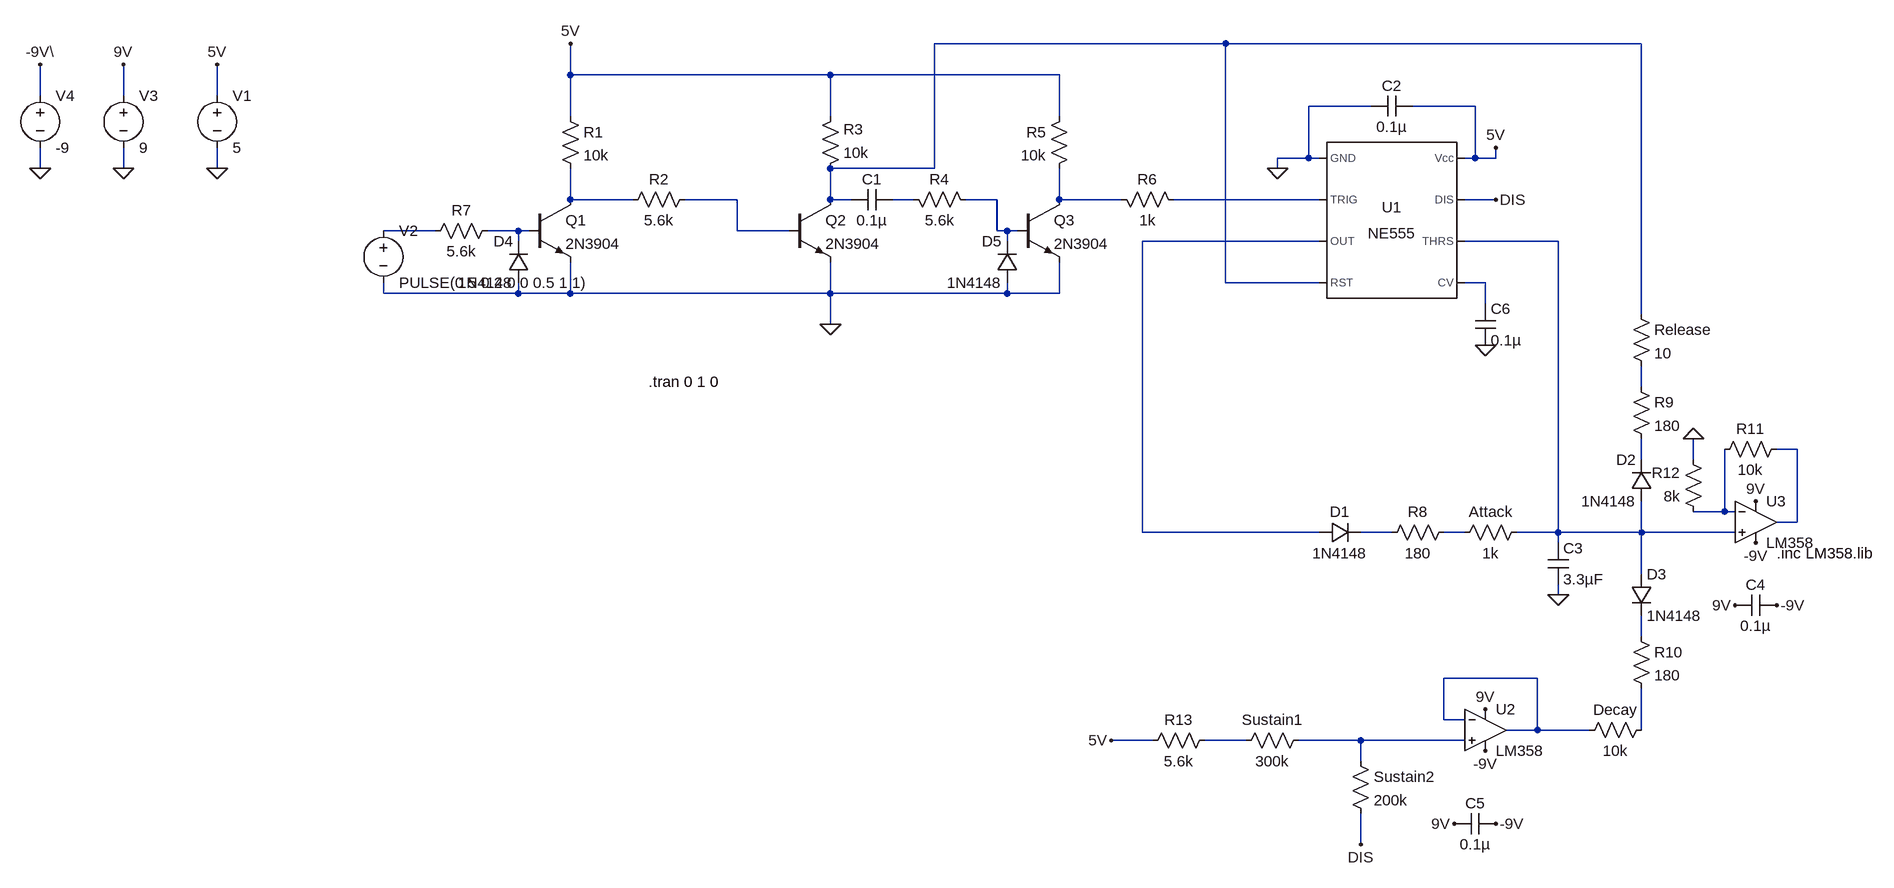
[diagram p0: schematic EnvelopeGenerator.asc]
EnvelopeGenerator.asc, the LTspice schematic file:
Version 4
SHEET 1 2560 1192
WIRE 1088 -128 640 -128
WIRE 1728 -128 1088 -128
WIRE 80 -80 80 -128
WIRE 480 -80 80 -80
WIRE 832 -80 480 -80
WIRE -736 -48 -736 -96
WIRE -608 -48 -608 -96
WIRE -464 -48 -464 -96
WIRE 1312 -32 1216 -32
WIRE 1472 -32 1376 -32
WIRE 80 -16 80 -80
WIRE 480 -16 480 -80
WIRE 832 -16 832 -80
WIRE 1216 48 1216 -32
WIRE 1216 48 1168 48
WIRE 1232 48 1216 48
WIRE 1472 48 1472 -32
WIRE 1472 48 1456 48
WIRE 1504 48 1504 32
WIRE 1504 48 1472 48
WIRE -736 64 -736 32
WIRE -608 64 -608 32
WIRE -464 64 -464 32
WIRE 640 64 640 -128
WIRE 640 64 480 64
WIRE 1168 64 1168 48
WIRE 80 112 80 64
WIRE 176 112 80 112
WIRE 336 112 256 112
WIRE 480 112 480 64
WIRE 512 112 480 112
WIRE 608 112 576 112
WIRE 736 112 688 112
WIRE 832 112 832 64
WIRE 928 112 832 112
WIRE 1232 112 1008 112
WIRE 1504 112 1456 112
WIRE -128 160 -208 160
WIRE 0 160 -48 160
WIRE 16 160 0 160
WIRE 336 160 336 112
WIRE 416 160 336 160
WIRE 736 160 736 112
WIRE 752 160 736 160
WIRE 768 160 752 160
WIRE 0 176 0 160
WIRE 752 176 752 160
WIRE 1232 176 960 176
WIRE 1600 176 1456 176
WIRE 1088 240 1088 -128
WIRE 1232 240 1088 240
WIRE 1488 240 1456 240
WIRE -208 256 -208 240
WIRE 0 256 0 240
WIRE 0 256 -208 256
WIRE 80 256 80 208
WIRE 80 256 0 256
WIRE 480 256 480 208
WIRE 480 256 80 256
WIRE 752 256 752 240
WIRE 752 256 480 256
WIRE 832 256 832 208
WIRE 832 256 752 256
WIRE 1488 272 1488 240
WIRE 1728 288 1728 -128
WIRE 480 304 480 256
WIRE 1728 400 1728 368
WIRE 1968 496 1936 496
WIRE 1728 512 1728 480
WIRE 1808 512 1808 480
WIRE 1856 592 1856 496
WIRE 1856 592 1808 592
WIRE 1872 592 1856 592
WIRE 1968 608 1968 496
WIRE 1968 608 1936 608
WIRE 960 624 960 176
WIRE 1232 624 960 624
WIRE 1344 624 1296 624
WIRE 1456 624 1424 624
WIRE 1600 624 1600 176
WIRE 1600 624 1536 624
WIRE 1728 624 1728 576
WIRE 1728 624 1600 624
WIRE 1872 624 1728 624
WIRE 1600 640 1600 624
WIRE 1728 688 1728 624
WIRE 1600 720 1600 704
WIRE 1728 784 1728 752
WIRE 1568 848 1424 848
WIRE 1424 912 1424 848
WIRE 1456 912 1424 912
WIRE 1568 928 1568 848
WIRE 1568 928 1520 928
WIRE 1648 928 1568 928
WIRE 1728 928 1728 864
WIRE 976 944 912 944
WIRE 1120 944 1056 944
WIRE 1296 944 1200 944
WIRE 1456 944 1296 944
WIRE 1296 976 1296 944
WIRE 1296 1104 1296 1056
FLAG 480 304 0
FLAG 80 -128 5V
FLAG -464 64 0
FLAG -464 -96 5V
FLAG 1168 64 0
FLAG 1504 32 5V
FLAG -608 64 0
FLAG -608 -96 9V
FLAG -736 64 0
FLAG -736 -96 -9V\
FLAG 1904 576 9V
FLAG 1904 640 -9V
FLAG 1600 720 0
FLAG 1872 736 9V
FLAG 1936 736 -9V
FLAG 1440 1072 9V
FLAG 1504 1072 -9V
FLAG 1488 896 9V
FLAG 1488 960 -9V
FLAG 1488 336 0
FLAG 912 944 5V
FLAG 1808 480 0
FLAG 1504 112 DIS
FLAG 1296 1104 DIS
SYMBOL npn 16 112 R0
SYMATTR InstName Q1
SYMATTR Value 2N3904
SYMBOL npn 416 112 R0
SYMATTR InstName Q2
SYMATTR Value 2N3904
SYMBOL npn 768 112 R0
SYMATTR InstName Q3
SYMATTR Value 2N3904
SYMBOL res 64 -32 R0
SYMATTR InstName R1
SYMATTR Value 10k
SYMBOL res 272 96 R90
WINDOW 0 0 56 VBottom 2
WINDOW 3 32 56 VTop 2
SYMATTR InstName R2
SYMATTR Value 5.6k
SYMBOL res 464 80 M180
WINDOW 0 36 76 Left 2
WINDOW 3 36 40 Left 2
SYMATTR InstName R3
SYMATTR Value 10k
SYMBOL res 704 128 M270
WINDOW 0 32 56 VTop 2
WINDOW 3 0 56 VBottom 2
SYMATTR InstName R4
SYMATTR Value 5.6k
SYMBOL res 848 -32 M0
SYMATTR InstName R5
SYMATTR Value 10k
SYMBOL res 912 96 M90
WINDOW 0 0 56 VBottom 2
WINDOW 3 32 56 VTop 2
SYMATTR InstName R6
SYMATTR Value 1k
SYMBOL res -32 144 R90
WINDOW 0 0 56 VBottom 2
WINDOW 3 32 56 VTop 2
SYMATTR InstName R7
SYMATTR Value 5.6k
SYMBOL cap 576 96 R90
WINDOW 0 0 32 VBottom 2
WINDOW 3 32 32 VTop 2
SYMATTR InstName C1
SYMATTR Value 0.1µ
SYMBOL voltage -464 -64 R0
WINDOW 123 0 0 Left 0
WINDOW 39 0 0 Left 0
SYMATTR InstName V1
SYMATTR Value 5
SYMBOL voltage -208 144 R0
WINDOW 123 0 0 Left 0
WINDOW 39 0 0 Left 0
SYMATTR InstName V2
SYMATTR Value PULSE(0 5 0.2 0 0 0.5 1 1)
SYMBOL Misc\\NE555 1344 144 R0
SYMATTR InstName U1
SYMBOL cap 1376 -48 R90
WINDOW 0 0 32 VBottom 2
WINDOW 3 32 32 VTop 2
SYMATTR InstName C2
SYMATTR Value 0.1µ
SYMBOL diode 1232 640 R270
WINDOW 0 32 32 VTop 2
WINDOW 3 0 32 VBottom 2
SYMATTR InstName D1
SYMATTR Value 1N4148
SYMBOL res 1440 608 R90
WINDOW 0 0 56 VBottom 2
WINDOW 3 32 56 VTop 2
SYMATTR InstName R8
SYMATTR Value 180
SYMBOL res 1552 608 R90
WINDOW 0 0 56 VBottom 2
WINDOW 3 32 56 VTop 2
SYMATTR InstName Attack
SYMATTR Value 1k
SYMBOL voltage -608 -64 R0
WINDOW 123 0 0 Left 0
WINDOW 39 0 0 Left 0
SYMATTR InstName V3
SYMATTR Value 9
SYMBOL voltage -736 -64 R0
WINDOW 123 0 0 Left 0
WINDOW 39 0 0 Left 0
SYMATTR InstName V4
SYMATTR Value -9
SYMBOL cap 1584 640 R0
SYMATTR InstName C3
SYMATTR Value 3.3µF
SYMBOL diode 1744 576 R180
WINDOW 0 24 64 Left 2
WINDOW 3 24 0 Left 2
SYMATTR InstName D2
SYMATTR Value 1N4148
SYMBOL res 1712 384 R0
SYMATTR InstName R9
SYMATTR Value 180
SYMBOL res 1712 272 R0
SYMATTR InstName Release
SYMATTR Value 10
SYMBOL diode 1712 688 R0
SYMATTR InstName D3
SYMATTR Value 1N4148
SYMBOL res 1712 768 R0
SYMATTR InstName R10
SYMATTR Value 180
SYMBOL res 1744 912 R90
WINDOW 0 0 56 VBottom 2
WINDOW 3 32 56 VTop 2
SYMATTR InstName Decay
SYMATTR Value 10k
SYMBOL cap 1936 720 R90
WINDOW 0 0 32 VBottom 2
WINDOW 3 32 32 VTop 2
SYMATTR InstName C4
SYMATTR Value 0.1µ
SYMBOL cap 1504 1056 R90
WINDOW 0 0 32 VBottom 2
WINDOW 3 32 32 VTop 2
SYMATTR InstName C5
SYMATTR Value 0.1µ
SYMBOL res 1216 928 R90
WINDOW 0 0 56 VBottom 2
WINDOW 3 32 56 VTop 2
SYMATTR InstName Sustain1
SYMATTR Value 300k
SYMBOL res 1952 480 R90
WINDOW 0 0 56 VBottom 2
WINDOW 3 32 56 VTop 2
SYMATTR InstName R11
SYMATTR Value 10k
SYMBOL res 1824 608 R180
WINDOW 0 36 76 Left 2
WINDOW 3 36 40 Left 2
SYMATTR InstName R12
SYMATTR Value 8k
SYMBOL cap 1472 272 R0
SYMATTR InstName C6
SYMATTR Value 0.1µ
SYMBOL res 1280 960 R0
SYMATTR InstName Sustain2
SYMATTR Value 200k
SYMBOL res 1072 928 R90
WINDOW 0 0 56 VBottom 2
WINDOW 3 32 56 VTop 2
SYMATTR InstName R13
SYMATTR Value 5.6k
SYMBOL Opamps\\opamp2 1488 864 R0
SYMATTR InstName U2
SYMATTR Value LM358
SYMBOL Opamps\\opamp2 1904 544 R0
SYMATTR InstName U3
SYMATTR Value LM358
SYMBOL diode 16 240 R180
WINDOW 0 24 64 Left 2
WINDOW 3 24 0 Left 2
SYMATTR InstName D4
SYMATTR Value 1N4148
SYMBOL diode 768 240 R180
WINDOW 0 24 64 Left 2
WINDOW 3 24 0 Left 2
SYMATTR InstName D5
SYMATTR Value 1N4148
TEXT 200 392 Left 2 !.tran 0 1 0
TEXT 1936 656 Left 2 !.inc LM358.lib

The netlist it stands for:
* EnvelopeGenerator.asc
Q1 N002 N009 0 0 2N3904
Q2 N001 N003 0 0 2N3904
Q3 N006 N005 0 0 2N3904
R1 5V N002 10k
R2 N003 N002 5.6k
R3 N001 5V 10k
R4 N005 N004 5.6k
R5 5V N006 10k
R6 N006 N007 1k
R7 N009 N008 5.6k
C1 N004 N001 0.1µ
V1 5V 0 5
V2 N008 0 PULSE(0 5 0.2 0 0 0.5 1 1)
XU1 0 N007 N010 N001 N012 N011 DIS 5V NE555  ; pins GND TRIG OUT RST CV THRS DIS Vcc
C2 5V 0 0.1µ
D1 N010 N017 1N4148
R8 N018 N017 180
R§Attack N011 N018 1k
V3 9V 0 9
V4 -9V\ 0 -9
C3 N011 0 3.3µF
D2 N011 N015 1N4148
R9 N013 N015 180
Release N001 N013 10
D3 N011 N019 1N4148
R10 N019 N021 180
R§Decay N021 N020 10k
C4 -9V 9V 0.1µ
C5 -9V 9V 0.1µ
R§Sustain1 N023 N022 300k
R11 N014 N016 10k
R12 N016 0 8k
C6 N012 0 0.1µ
R§Sustain2 N023 DIS 200k
R13 N022 5V 5.6k
XU2 N023 N020 9V -9V N020 LM358  ; pins In+ In- V+ V- OUT
XU3 N011 N016 9V -9V N014 LM358  ; pins In+ In- V+ V- OUT
D4 0 N009 1N4148
D5 0 N005 1N4148
.model D D
.lib standard.dio
.model NPN NPN
.model PNP PNP
.lib standard.bjt
.tran 0 1 0
.inc LM358.lib
.lib NE555.sub
.backanno
.end